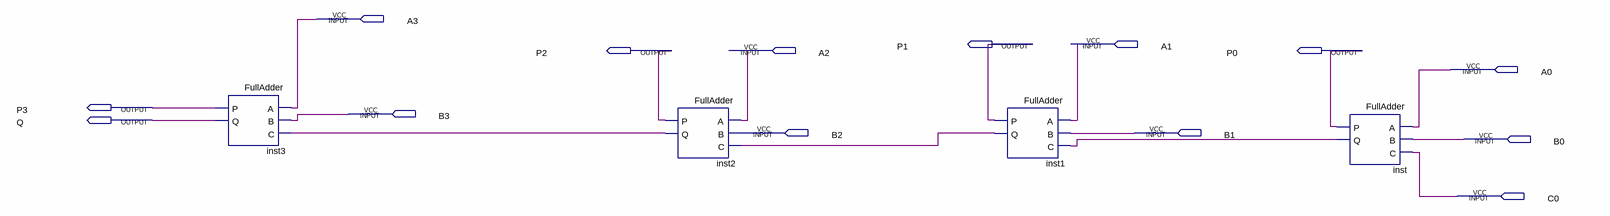
[diagram p0: schematic sheet]
// Quartus schematic RippleCarryAdder.bdf as structural Verilog: 4 symbols, 14 pins
module RippleCarryAdder (
  input  A3,
  input  A1,
  input  A2,
  input  A0,
  input  B3,
  input  B2,
  input  B1,
  input  B0,
  input  C0,
  output P1,
  output P2,
  output P0,
  output P3,
  output Q
);

  wire inst1_q, inst2_q, inst_q;

  FullAdder inst3 (.A(A3), .B(B3), .C(inst2_q), .P(P3), .Q(Q));
  FullAdder inst2 (.A(A2), .B(B2), .C(inst1_q), .P(P2), .Q(inst2_q));
  FullAdder inst1 (.A(A1), .B(B1), .C(inst_q), .P(P1), .Q(inst1_q));
  FullAdder inst (.A(A0), .B(B0), .C(C0), .P(P0), .Q(inst_q));
endmodule
